# EAGLE design Timer (EAGLE 9.5.1)
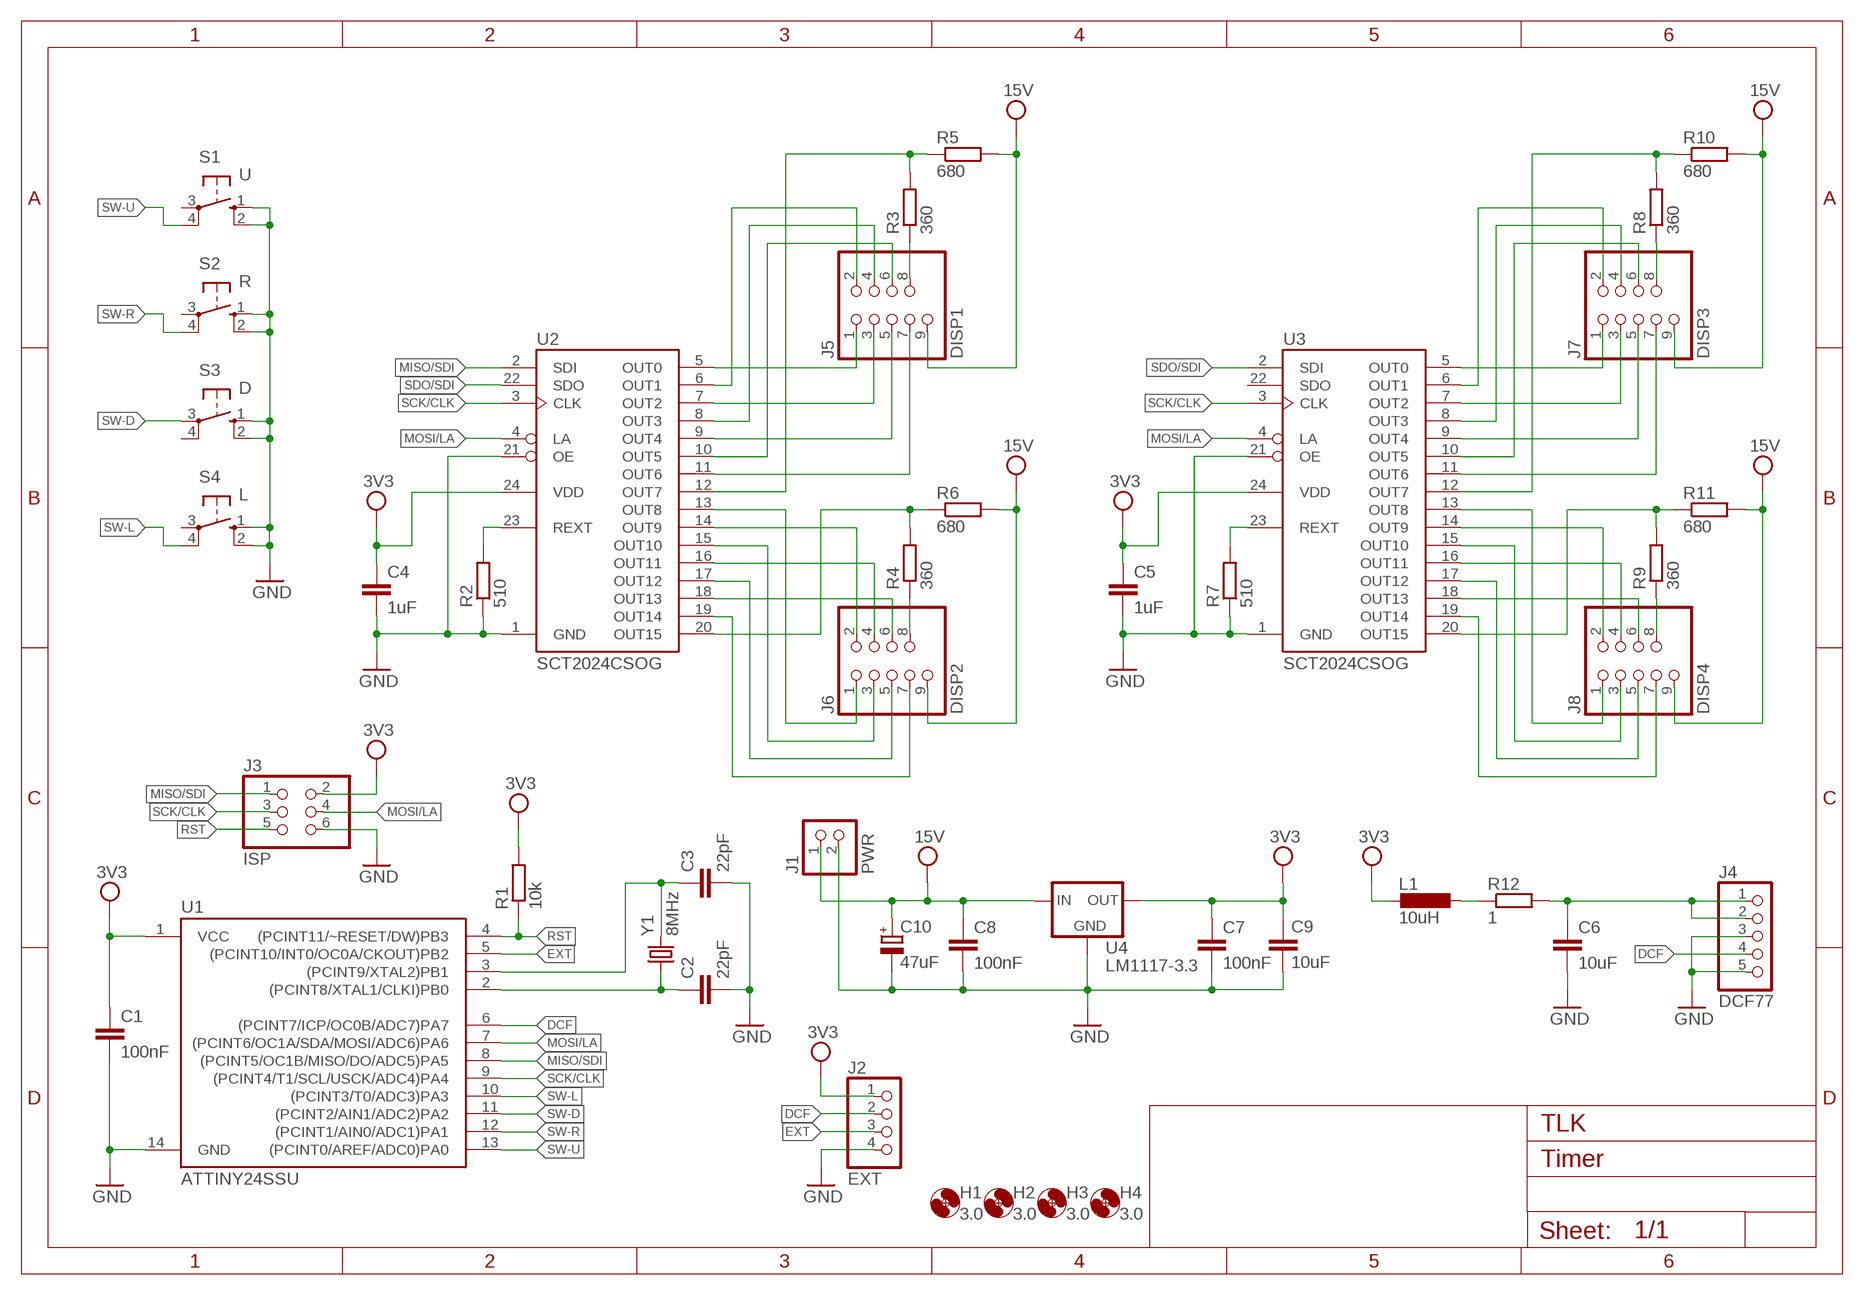
[diagram p0: schematic, sheet 1]

## Parts
C1  100nF  C-EUC0805  [C0805]
C2  22pF  C-EUC0805  [C0805]
C3  22pF  C-EUC0805  [C0805]
C4  1uF  C-EUC0805  [C0805]
C5  1uF  C-EUC0805  [C0805]
C6  10uF  C-EUC0805  [C0805]
C7  100nF  C-EUC0805  [C0805]
C8  100nF  C-EUC0805  [C0805]
C9  10uF  C-EUC0805  [C0805]
C10  47uF  CPOL-EUE2.5  [E2,5]
H1  3.0  MOUNT-HOLE3.0  [3,0]
H2  3.0  MOUNT-HOLE3.0  [3,0]
H3  3.0  MOUNT-HOLE3.0  [3,0]
H4  3.0  MOUNT-HOLE3.0  [3,0]
J1  PWR  PINHD-1X2/90  [1X02/90]
J2  EXT  PINHD-1X4/90  [1X04/90]
J3  ISP  PINHD-2X3/90  [2X03/90]
J4  DCF77  PINHD-1X5/90  [1X05/90]
J5  DISP1  PINHD-2X4/5/90  [2X04/05/90]
J6  DISP2  PINHD-2X4/5/90  [2X04/05/90]
J7  DISP3  PINHD-2X4/5/90  [2X04/05/90]
J8  DISP4  PINHD-2X4/5/90  [2X04/05/90]
L1  10uH  L-EUL0805  [L0805]
R1  10k  R-EUR0805  [R0805]
R2  510  R-EUR0805  [R0805]
R3  360  R-EUR1206  [R1206]
R4  360  R-EUR1206  [R1206]
R5  680  R-EUR1206  [R1206]
R6  680  R-EUR1206  [R1206]
R7  510  R-EUR0805  [R0805]
R8  360  R-EUR1206  [R1206]
R9  360  R-EUR1206  [R1206]
R10  680  R-EUR1206  [R1206]
R11  680  R-EUR1206  [R1206]
R12  1  R-EUR0805  [R0805]
S1  U  TACT  [TACT-12]
S2  R  TACT  [TACT-12]
S3  D  TACT  [TACT-12]
S4  L  TACT  [TACT-12]
U1  ATTINY24SSU  [SO14]
U2  SCT2024CSOG  [SO24W]
U3  SCT2024CSOG  [SO24W]
U4  LM1117-3.3  [SOT223]
Y1  8MHz  CRYSTALHC49UP  [HC49UP]

## Nets
DCF: J2.2 J4.4 U1.6((PCINT7/ICP/OC0B/ADC7)PA7)
EXT: J2.3 U1.5((PCINT10/INT0/OC0A/CKOUT)PB2)
GND: C1.2 C2.2 C3.2 C4.2 C5.2 C6.2 C7.2 C8.2 C9.2 C10.- J1.2 J2.4 J3.6 J4.3 J4.5 R2.1 R7.1 S1.1(S) S1.2(S1) S2.1(S) S2.2(S1) S3.1(S) S3.2(S1) S4.1(S) S4.2(S1) U1.14(GND) U2.1(GND) U2.21(OE) U3.1(GND) U3.21(OE) U4.1(GND)
MISO/SDI: J3.1 U1.8((PCINT5/OC1B/MISO/DO/ADC5)PA5) U2.2(SDI)
MOSI/LA: J3.4 U1.7((PCINT6/OC1A/SDA/MOSI/ADC6)PA6) U2.4(LA) U3.4(LA)
N$1: C3.1 U1.3((PCINT9/XTAL2)PB1) Y1.2
N$2: C2.1 U1.2((PCINT8/XTAL1/CLKI)PB0) Y1.1
N$3: C6.1 J4.1 J4.2 R12.2
N$4: J5.1 U2.5(OUT0)
N$5: J5.2 U2.6(OUT1)
N$6: J5.3 U2.7(OUT2)
N$7: J5.4 U2.8(OUT3)
N$8: J5.5 U2.9(OUT4)
N$9: J5.6 U2.10(OUT5)
N$10: J5.8 R3.1
N$11: J5.7 U2.11(OUT6)
N$12: R3.2 R5.1 U2.12(OUT7)
N$13: J6.2 U2.14(OUT9)
N$14: J7.1 U3.5(OUT0)
N$15: J7.3 U3.7(OUT2)
N$16: J7.5 U3.9(OUT4)
N$17: J7.7 U3.11(OUT6)
N$18: J7.2 U3.6(OUT1)
N$19: J7.4 U3.8(OUT3)
N$20: J7.6 U3.10(OUT5)
N$21: J7.8 R8.1
N$22: J6.4 U2.16(OUT11)
N$23: R8.2 R10.1 U3.12(OUT7)
N$24: J8.2 U3.14(OUT9)
N$25: J8.4 U3.16(OUT11)
N$26: J8.6 U3.18(OUT13)
N$27: R9.2 R11.1 U3.20(OUT15)
N$28: J8.8 R9.1
N$29: L1.1 R12.1
N$30: J8.1 U3.13(OUT8)
N$31: J8.3 U3.15(OUT10)
N$32: J8.5 U3.17(OUT12)
N$33: J6.6 U2.18(OUT13)
N$34: J6.8 R4.1
N$35: J6.7 U2.19(OUT14)
N$36: J6.5 U2.17(OUT12)
N$37: R7.2 U3.23(REXT)
N$38: R2.2 U2.23(REXT)
N$39: J6.3 U2.15(OUT10)
N$40: J6.1 U2.13(OUT8)
N$41: R4.2 R6.1 U2.20(OUT15)
N$42: J8.7 U3.19(OUT14)
RST: J3.5 R1.1 U1.4((PCINT11/~RESET/DW)PB3)
SCK/CLK: J3.3 U1.9((PCINT4/T1/SCL/USCK/ADC4)PA4) U2.3(CLK) U3.3(CLK)
SDO/SDI: U2.22(SDO) U3.2(SDI)
SW-D: S3.3(P) U1.11((PCINT2/AIN1/ADC2)PA2)
SW-L: S4.4(P1) U1.10((PCINT3/T0/ADC3)PA3)
SW-R: S2.4(P1) U1.12((PCINT1/AIN0/ADC1)PA1)
SW-U: S1.4(P1) U1.13((PCINT0/AREF/ADC0)PA0)
VCC: C1.1 C4.1 C5.1 C7.1 C9.1 J2.1 J3.2 L1.2 R1.2 U1.1(VCC) U2.24(VDD) U3.24(VDD) U4.2(OUT) U4.4(OUT) ; supply symbol labelled 3V3
VDD: C8.1 C10.+ J1.1 J5.9 J6.9 J7.9 J8.9 R5.2 R6.2 R10.2 R11.2 U4.3(IN) ; supply symbol labelled 15V
Unconnected: S1.3(P) S2.3(P) S3.4(P1) S4.3(P) U3.22(SDO)

## Notes on the sheet
- TLK

## Library data of the parts
C1-C9 = Timer:C-EU: CAPACITOR, European symbol
C10 = Timer:CPOL-EU: POLARIZED CAPACITOR, European symbol
H1-H4 = holes:MOUNT-HOLE: MOUNTING HOLE with drill center marker
J1 = Timer:PINHD-1X2: PIN HEADER
J2 = Timer:PINHD-1X4: PIN HEADER
J3 = Timer:PINHD-2X3: PIN HEADER
J4 = Timer:PINHD-1X5: PIN HEADER
J5-J8 = Timer:PINHD-2X4/5: PIN HEADER
L1 = Timer:L-EU: INDUCTOR, European symbol
R1-R12 = Timer:R-EU: RESISTOR, European symbol
S1-S4 = Timer:TACT: Tact switch
U1 = Timer:ATTINY24: MICROCONTROLLER 2 Kbytes FLASH 128 bytes SRAM 128 bytes EEPROM
U2 U3 = Timer:SCT2024: LED driver
U4 = Timer:LM1117-3.3: Low drop fixed and adjustable positive voltage regulators 1 A
Y1 = Timer:CRYSTAL: CRYSTAL

## Board
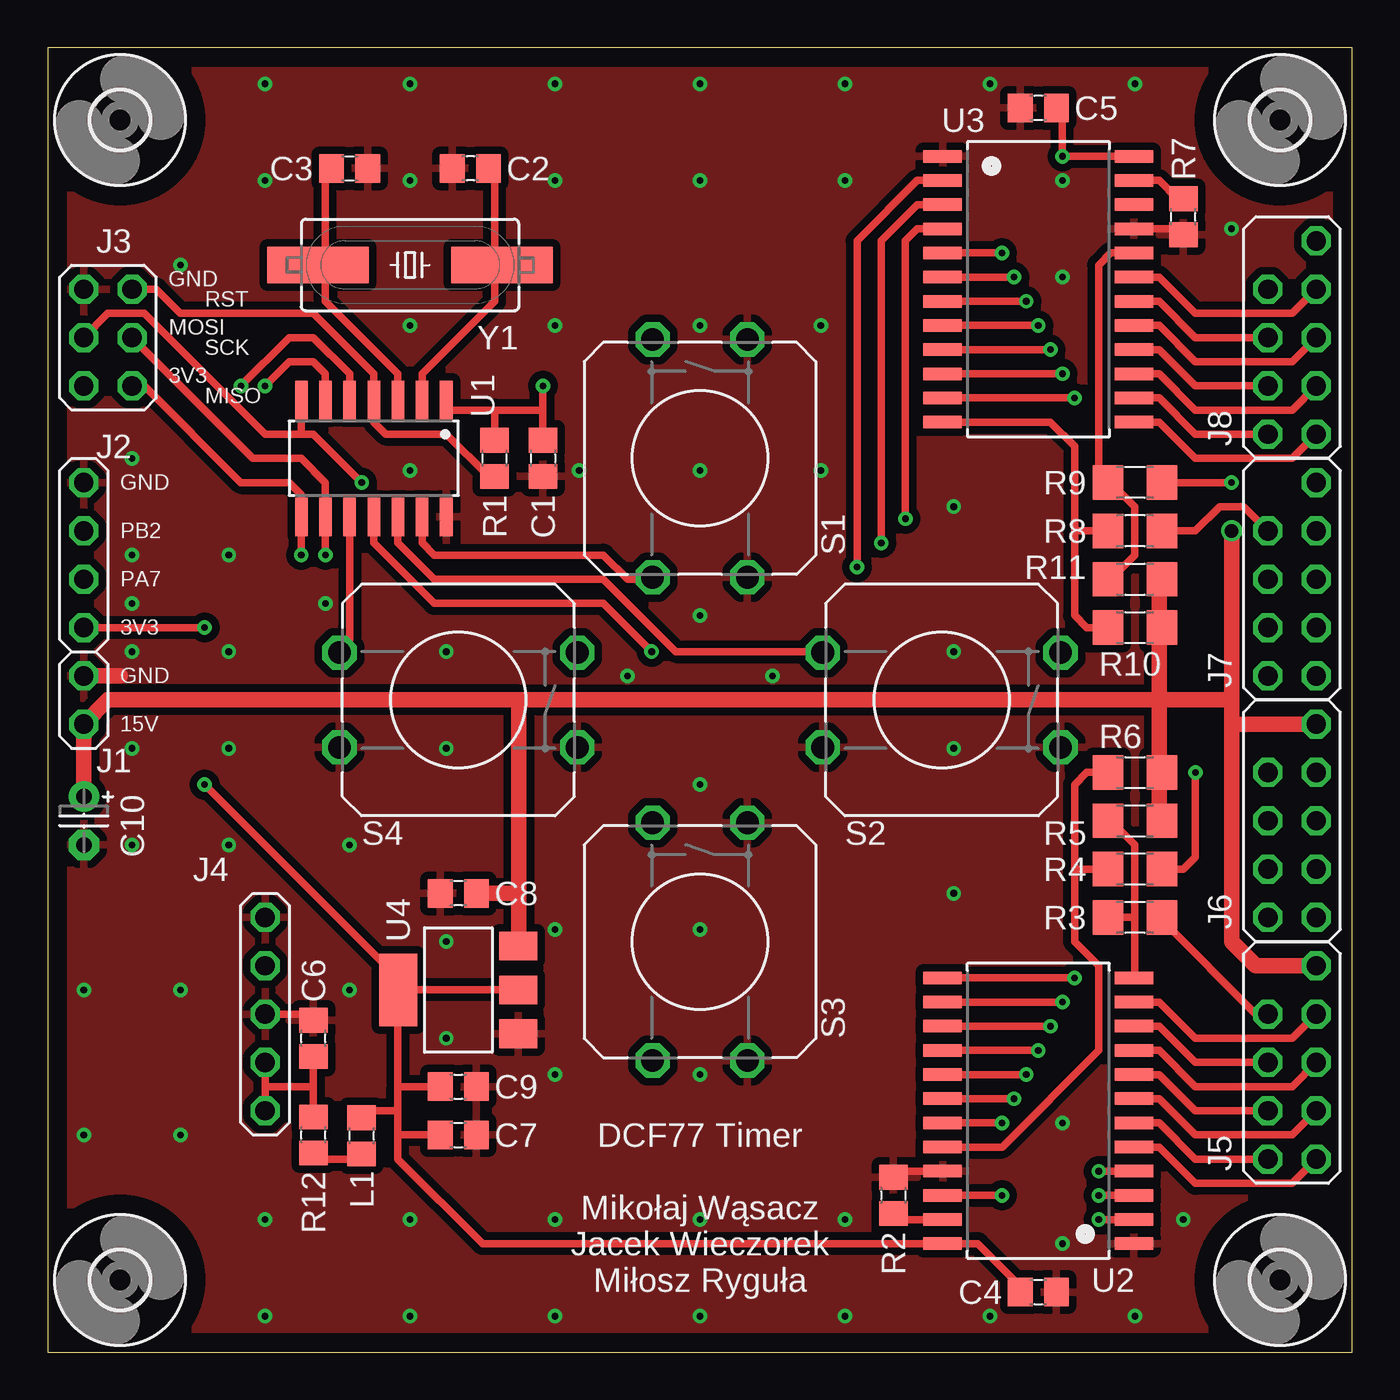
[diagram p1: board, top side]
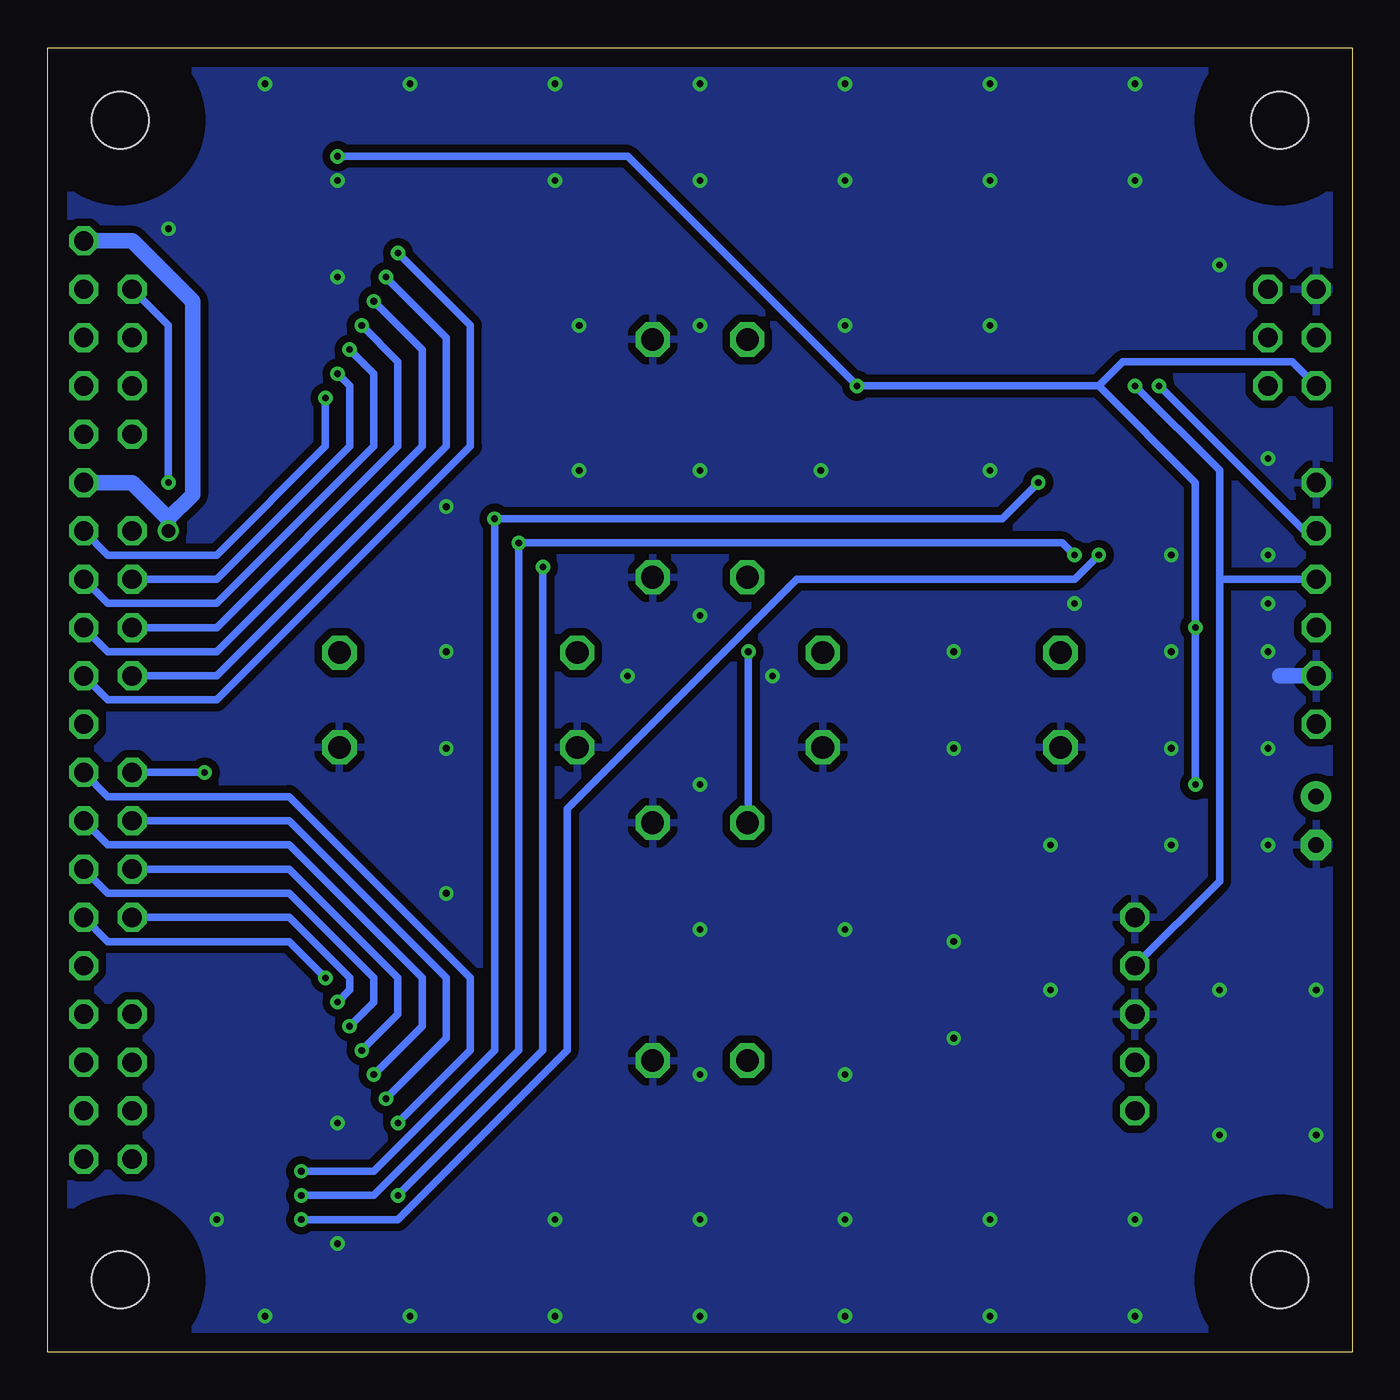
[diagram p2: board, bottom side, seen from below]

Size 68.58 x 68.58 mm. Coordinates in mm from the lower left corner, seen from the top.
Outline: 0,0 68.58,0 68.58,68.58 0,68.58 0,0
Copper layers (1*16): Top 0.035mm / dielectric 1.5mm / Bottom 0.035mm
Design rules "default *": minimum track width 6mil, minimum drill 0.35mm, track to track 12mil, track to pad 12mil, pad to pad 12mil, via to via 12mil, smd to smd 12mil, copper to edge 40mil, drill to drill 12mil, minimum pad ring 10mil, minimum via ring 8mil, stop-mask expansion 4mil, vias tented up to drill 32mil, thermal gap 16mil

### Footprints (pad centres in the part's own frame; a part is rotated, then mirrored left to right if it is on the bottom)
C0805 = smd 1.3 x 1.5: 1 -0.95,0; 2 0.95,0
E2,5 = drill 0.813 pad 1.6: + -1.27,0 | drill 0.813 pad 1.6 octagon: - 1.27,0
3,0 = hole 3: 0,0
1X02/90 = drill 1.016 octagon: 1 -1.27,0; 2 1.27,0
1X04/90 = drill 1.016 octagon: 1 -3.81,0; 2 -1.27,0; 3 1.27,0; 4 3.81,0
2X03/90 = drill 1.016 octagon: 1 -2.54,-1.27; 2 -2.54,1.27; 3 0,-1.27; 4 0,1.27; 5 2.54,-1.27; 6 2.54,1.27
1X05/90 = drill 1.016 octagon: 1 -5.08,0; 2 -2.54,0; 3 0,0; 4 2.54,0; 5 5.08,0
2X04/05/90 = drill 1.016 octagon: 1 -5.08,-1.27; 2 -5.08,1.27; 3 -2.54,-1.27; 4 -2.54,1.27; 5 0,-1.27; 6 0,1.27; 7 2.54,-1.27; 8 2.54,1.27; 9 5.08,-1.27
L0805 = smd 1.3 x 1.5: 1 -0.95,0; 2 0.95,0
R0805 = smd 1.3 x 1.5: 1 -0.95,0; 2 0.95,0
R1206 = smd 1.6 x 1.803: 1 -1.422,0; 2 1.422,0
TACT-12 = drill 1.194 octagon: 1 -6.248,2.489; 2 6.248,2.489; 3 -6.248,-2.489; 4 6.248,-2.489
SO14 = smd 0.66 x 2.032: 1 -3.81,-3.073; 2 -2.54,-3.073; 3 -1.27,-3.073; 4 0,-3.073; 5 1.27,-3.073; 6 2.54,-3.073; 7 3.81,-3.073; 8 3.81,3.073; 9 2.54,3.073; 10 1.27,3.073; 11 0,3.073; 12 -1.27,3.073; 13 -2.54,3.073; 14 -3.81,3.073
SO24W = smd 0.66 x 2.032: 1 -6.985,-5.029; 2 -5.715,-5.029; 3 -4.445,-5.029; 4 -3.175,-5.029; 5 -1.905,-5.029; 6 -0.635,-5.029; 7 0.635,-5.029; 8 1.905,-5.029; 9 3.175,-5.029; 10 4.445,-5.029; 11 5.715,-5.029; 12 6.985,-5.029; 13 6.985,5.029; 14 5.715,5.029; 15 4.445,5.029; 16 3.175,5.029; 17 1.905,5.029; 18 0.635,5.029; 19 -0.635,5.029; 20 -1.905,5.029; 21 -3.175,5.029; 22 -4.445,5.029; 23 -5.715,5.029; 24 -6.985,5.029
SOT223 = smd 1.5 x 2: 1 -2.3,-3.15; 2 0,-3.15; 3 2.3,-3.15 | smd 3.8 x 2: 4 0,3.15
HC49UP = smd 5.334 x 1.93: 1 -4.826,0; 2 4.826,0

### Placement (x,y rotation side)
C1  26.04,46.99 270 top
C2  22.23,62.23 180 top
C3  15.88,62.23 0 top
C4  52.07,3.17 0 top
C5  52.07,65.41 180 top
C6  13.97,16.51 90 top
C7  21.59,11.43 0 top
C8  21.59,24.13 180 top
C9  21.59,13.97 0 top
C10  1.91,27.94 270 top
H1  64.77,64.77 0 top
H2  64.77,3.81 0 top
H3  3.81,3.81 0 top
H4  3.81,64.77 0 top
J1  1.91,34.29 90 top
J2  1.91,41.91 90 top
J3  3.17,53.34 90 top
J4  11.43,17.78 90 top
J5  65.41,15.24 90 top
J6  65.41,27.94 90 top
J7  65.41,40.64 90 top
J8  65.41,53.34 90 top
L1  16.51,11.38 90 top
R1  23.5,46.99 90 top
R2  44.45,8.26 270 top
R3  57.15,22.86 180 top
R4  57.15,25.4 180 top
R5  57.15,27.94 0 top
R6  57.15,30.48 0 top
R7  59.69,59.69 90 top
R8  57.15,43.18 180 top
R9  57.15,45.72 180 top
R10  57.15,38.1 0 top
R11  57.15,40.64 0 top
R12  13.97,11.43 90 top
S1  34.29,46.99 270 top
S2  46.99,34.29 180 top
S3  34.29,21.59 270 top
S4  21.59,34.29 180 top
U1  17.14,46.99 180 top
U2  52.07,12.7 90 top
U3  52.07,55.88 270 top
U4  21.59,19.05 90 top
Y1  19.05,57.15 180 top

### Tracks (layer width: path | path; a pad name or v marks a point on that pad's centre or on a via)
DCF  (via drill 0.35)
  Top 0.406: v11.43,50.8 12.7,52.07 13.97,52.07 14.61,51.44 U1.6
  Bottom 0.406: 6.99,40.64 6.99,46.35 v11.43,50.8 | J2.2 6.99,40.64 | J4.4 6.99,24.77 6.99,40.64
EXT  (via drill 0.35)
  Top 0.406: U1.5 15.88,51.44 13.97,53.34 12.7,53.34 v10.16,50.8
  Bottom 0.406: v10.16,50.8 2.54,43.18 J2.3
GND  (via drill 0.35)
  Top 0.406: J4.3 13.65,17.78 C6.2 | R2.1 44.77,9.53 U2.21 | R7.1 59.38,59.05 U3.21
  Top 0.813: J1.2 3.81,35.56
  Bottom 0.813: J1.2 3.81,35.56
  other vias: 1.91,11.43 11.43,1.91 57.15,1.91 62.23,59.05 57.15,66.67 11.43,66.67 6.99,11.43 19.05,1.91 26.67,1.91 34.29,1.91 41.91,1.91 49.53,1.91 4.45,36.83 4.45,39.37 4.45,41.91 4.45,46.99 9.53,41.91 9.53,36.83 14.61,39.37 20.95,36.83 4.45,31.75 19.05,53.98 19.05,61.59 6.99,57.15 53.34,12.06 9.53,31.75 26.67,53.98 53.34,56.52 47.62,44.45 47.62,36.83 47.62,31.75 47.62,24.13 15.88,19.05 27.94,46.35 19.05,46.35 19.05,66.67 26.67,66.67 34.29,66.67 41.91,66.67 49.53,66.67 30.48,35.56 38.1,35.56 34.29,29.84 34.29,22.23 26.67,22.23 26.67,6.99 34.29,6.99 41.91,6.99 26.67,14.61 53.34,5.71 34.29,14.61 53.34,61.59 41.91,61.59 40.64,46.35 34.29,46.35 34.29,53.98 40.64,53.98 26.67,61.59 34.29,61.59 1.91,19.05 4.45,26.67 9.53,26.67 15.88,26.67 20.95,31.75 19.05,6.99 34.29,38.73 20.95,16.51 11.43,6.99 11.43,61.59 6.99,19.05 59.69,6.99 20.95,21.59
  pour Top (isolate 0.406): 0,68.58 68.58,68.58 68.58,0 0,0
  pour Bottom (isolate 0.406): 0,68.58 68.58,68.58 68.58,0 0,0
MISO/SDI  (via drill 0.35)
  Top 0.406: J3.1 5.08,50.8 10.16,45.72 12.7,45.72 13.34,45.09 U1.8 v13.34,41.91 | v55.24,6.99 U2.2
  Bottom 0.406: v13.34,41.91 14.61,40.64 29.21,40.64 41.27,28.57 41.27,15.88 50.16,6.99 v55.24,6.99
MOSI/LA  (via drill 0.35)
  Top 0.406: J3.4 3.17,54.61 5.08,54.61 11.43,48.26 13.34,48.26 | 13.34,48.26 13.97,48.26 v16.51,45.72 | U1.7 13.34,48.26 | v55.24,9.53 U2.4 | v45.09,43.81 45.09,58.42 45.72,59.05 U3.4
  Bottom 0.406: v16.51,45.72 18.41,43.81 v45.09,43.81 45.09,15.88 51.44,9.53 v55.24,9.53
N$1
  Top 0.406: U1.3 18.41,51.44 14.61,55.24 14.61,57.15 | 14.61,57.15 14.61,61.91 C3.1 | Y1.2 14.61,57.15
N$2
  Top 0.406: U1.2 19.68,51.44 23.5,55.24 23.5,57.15 | 23.5,57.15 23.5,61.91 C2.1 | Y1.1 23.5,57.15
N$3
  Top 0.406: J4.1 11.43,13.97 | 11.43,13.97 J4.2 | C6.1 13.97,13.97 | 13.97,13.97 11.43,13.97 | 13.97,13.97 R12.2
N$4
  Top 0.406: J5.1 65.41,8.89 60.33,8.89 58.42,10.79 U2.5
N$5
  Top 0.406: J5.2 60.33,10.16 58.42,12.06 U2.6
N$6
  Top 0.406: J5.3 65.41,11.43 60.33,11.43 58.42,13.34 U2.7
N$7
  Top 0.406: J5.4 60.33,12.7 58.42,14.61 U2.8
N$8
  Top 0.406: J5.5 65.41,13.97 60.33,13.97 58.42,15.88 U2.9
N$9
  Top 0.406: J5.6 60.33,15.24 58.42,17.14 U2.10
N$10
  Top 0.406: J5.8 63.5,17.78 58.57,22.71 R3.1
N$11
  Top 0.406: J5.7 65.41,16.51 60.33,16.51 58.42,18.41 U2.11
N$12
  Top 0.406: R5.1 55.88,27.94 57.15,26.67 57.15,22.86 | U2.12 57.15,19.74 57.15,22.86 | 57.15,22.86 R3.2
N$13  (via drill 0.35)
  Top 0.406: U2.14 v53.34,18.41
  Bottom 0.406: J6.2 55.88,22.86 52.7,19.68 52.7,19.05 v53.34,18.41
N$14  (via drill 0.35)
  Top 0.406: v50.16,57.78 U3.5
  Bottom 0.406: J7.1 65.41,34.29 59.69,34.29 46.35,47.62 46.35,53.98 v50.16,57.78
N$15  (via drill 0.35)
  Top 0.406: v51.44,55.24 U3.7
  Bottom 0.406: J7.3 65.41,36.83 59.69,36.83 48.9,47.62 48.9,52.7 v51.44,55.24
N$16  (via drill 0.35)
  Top 0.406: v52.7,52.7 U3.9
  Bottom 0.406: J7.5 65.41,39.37 59.69,39.37 51.44,47.62 51.44,51.44 v52.7,52.7
N$17  (via drill 0.35)
  Top 0.406: v53.98,50.16 U3.11
  Bottom 0.406: J7.7 65.41,41.91 59.69,41.91 53.98,47.62 v53.98,50.16
N$18  (via drill 0.35)
  Top 0.406: v50.8,56.52 U3.6
  Bottom 0.406: J7.2 59.69,35.56 47.62,47.62 47.62,53.34 v50.8,56.52
N$19  (via drill 0.35)
  Top 0.406: v52.07,53.98 U3.8
  Bottom 0.406: J7.4 59.69,38.1 50.16,47.62 50.16,52.07 v52.07,53.98
N$20  (via drill 0.35)
  Top 0.406: v53.34,51.44 U3.10
  Bottom 0.406: J7.6 59.69,40.64 52.7,47.62 52.7,50.8 v53.34,51.44
N$21
  Top 0.406: J7.8 62.87,44.45 61.59,44.45 60.33,43.18 R8.1
N$22  (via drill 0.35)
  Top 0.406: U2.16 v52.07,15.88
  Bottom 0.406: J6.4 55.88,25.4 50.16,19.68 50.16,17.78 v52.07,15.88
N$23
  Top 0.406: U3.12 52.7,48.9 53.98,47.62 53.98,43.18 | 53.98,43.18 53.98,38.73 54.61,38.1 R10.1 | 53.98,43.18 R8.2
N$24
  Top 0.406: J8.2 60.33,48.26 58.42,50.16 U3.14
N$25
  Top 0.406: J8.4 60.33,50.8 58.42,52.7 U3.16
N$26
  Top 0.406: J8.6 60.33,53.34 58.42,55.24 U3.18
N$27
  Top 0.406: U3.20 55.88,57.78 55.24,57.15 55.24,49.53 55.24,46.35 55.88,45.72 | 55.88,45.72 57.15,44.45 57.15,41.91 55.88,40.64 R11.1 | R9.2 55.88,45.72
N$28  (via drill 0.35)
  Top 0.406: v62.23,45.72 R9.1
  Bottom 0.406: J8.8 62.23,53.98 v62.23,45.72
N$29
  Top 0.406: R12.1 14.29,10.16 16.23,10.16 L1.1
N$30
  Top 0.406: J8.1 65.41,46.99 60.33,46.99 58.42,48.9 U3.13
N$31
  Top 0.406: J8.3 65.41,49.53 60.33,49.53 58.42,51.44 U3.15
N$32
  Top 0.406: J8.5 65.41,52.07 60.33,52.07 58.42,53.98 U3.17
N$33  (via drill 0.35)
  Top 0.406: U2.18 v50.8,13.34
  Bottom 0.406: J6.6 55.88,27.94 47.62,19.68 47.62,16.51 v50.8,13.34
N$34  (via drill 0.35)
  Top 0.406: v60.33,30.48 60.33,26.04 59.69,25.4 R4.1
  Bottom 0.406: J6.8 v60.33,30.48
N$35  (via drill 0.35)
  Top 0.406: U2.19 v50.16,12.06
  Bottom 0.406: J6.7 65.41,29.21 55.88,29.21 46.35,19.68 46.35,15.88 v50.16,12.06
N$36  (via drill 0.35)
  Top 0.406: U2.17 v51.44,14.61
  Bottom 0.406: J6.5 65.41,26.67 55.88,26.67 48.9,19.68 48.9,17.14 v51.44,14.61
N$37
  Top 0.406: U3.23 58.42,61.59 59.38,60.64 R7.2
N$38
  Top 0.406: U2.23 44.77,6.99 R2.2
N$39  (via drill 0.35)
  Top 0.406: U2.15 v52.7,17.14
  Bottom 0.406: J6.3 65.41,24.13 55.88,24.13 51.44,19.68 51.44,18.41 v52.7,17.14
N$40  (via drill 0.35)
  Top 0.406: U2.13 v53.98,19.68
  Bottom 0.406: v53.98,19.68 55.88,21.59 65.41,21.59 J6.1
N$41
  Top 0.406: U2.20 50.16,10.79 55.24,15.88 55.24,20.32 53.98,21.59 53.98,25.4 | 53.98,25.4 53.98,29.84 54.61,30.48 R6.1 | 53.98,25.4 R4.2
N$42
  Top 0.406: J8.7 65.41,54.61 60.33,54.61 58.42,56.52 U3.19
RST
  Top 0.406: J3.5 5.71,55.88 6.99,54.61 13.97,54.61 17.14,51.44 U1.4 17.14,48.9 17.78,48.26 20.95,48.26 23.18,46.04 R1.1
SCK/CLK  (via drill 0.35)
  Top 0.406: U3.3 45.72,60.33 43.81,58.42 v43.81,42.55 | U2.3 v55.24,8.26 | v14.61,41.91 U1.9 14.61,45.72 13.34,46.99 10.79,46.99 J3.3
  Bottom 0.406: v55.24,8.26 51.44,8.26 43.81,15.88 v43.81,42.55 15.24,42.55 v14.61,41.91
SDO/SDI  (via drill 0.35)
  Top 0.406: U2.22 v50.16,8.26 | U3.2 45.72,61.59 42.55,58.42 v42.55,41.27
  Bottom 0.406: v42.55,41.27 42.55,15.88 v50.16,8.26
SW-D  (via drill 0.35)
  Top 0.406: U1.11 17.14,42.55 20.32,39.37 29.21,39.37 v31.75,36.83
  Bottom 0.406: S3.3 31.75,27.89 v31.75,36.83
SW-L
  Top 0.406: U1.10 15.88,38.1 15.88,37.47 15.24,36.83 15.29,36.78 S4.4
SW-R
  Top 0.406: U1.12 18.41,42.55 20.32,40.64 29.21,40.64 33.02,36.83 40.69,36.83 S2.4
SW-U
  Top 0.406: U1.13 19.68,42.55 20.32,41.91 29.21,41.91 30.48,40.64 31.7,40.64 S1.4
VCC  (via drill 0.35)
  Top 0.406: 18.41,19.02 U4.4 U4.2 | 18.41,19.02 18.41,13.97 | C9.1 18.41,13.97 | C7.1 18.41,11.43 | 18.41,11.43 18.41,10.16 22.86,5.71 U2.24 48.9,5.71 51.12,3.49 C4.1 | 18.41,11.43 18.41,12.7 | 18.41,12.7 18.41,13.97 | v8.26,29.84 18.41,19.68 18.41,19.02 | U3.24 v53.34,62.87 53.34,65.08 C5.1 | v8.26,38.1 J2.1 | v26.04,50.8 26.04,49.53 | 23.5,49.53 21.02,49.53 21.02,50 U1.1 | R1.2 23.5,49.53 | 23.5,49.53 26.04,49.53 | 26.04,49.53 C1.1 | 18.41,12.7 16.88,12.7 L1.2
  Bottom 0.406: J3.2 3.17,52.07 12.06,52.07 13.34,50.8 | v53.34,62.87 38.1,62.87 v26.04,50.8 13.34,50.8 | v8.26,29.84 v8.26,38.1 8.26,45.72 13.34,50.8
VDD  (via drill 0.7)
  Top 0.813: C10.+ J1.1 3.17,34.29 24.77,34.29 | U4.3 24.77,21.38 24.77,24.13 | 24.77,34.29 24.77,24.13 | C8.1 24.77,24.13 | 24.77,34.29 58.42,34.29 | 58.42,34.29 62.23,34.29 | 62.23,34.29 62.23,33.02 | 62.23,33.02 J6.9 | J5.9 63.5,20.32 62.23,21.59 62.23,33.02 | v62.23,43.18 62.23,34.29 | 58.42,38.1 58.42,40.64 R11.2 | 58.42,38.1 58.42,34.29 | R10.2 58.42,38.1 | 58.42,34.29 58.42,30.48 | 58.42,30.48 58.42,27.94 R5.2 | R6.2 58.42,30.48
  Bottom 0.813: J7.9 64.14,45.72 62.23,43.81 | v62.23,43.18 62.23,43.81 | J8.9 64.14,58.42 60.96,55.24 60.96,45.09 62.23,43.81

### Text on the board
tPlace: DCF77 Timer / / Mikołaj Wąsacz / Jacek Wieczorek / Miłosz Ryguła
tNames: GND | RST | MOSI | SCK | 3V3 | MISO | GND | PB2 | PA7 | 3V3 | GND | 15V